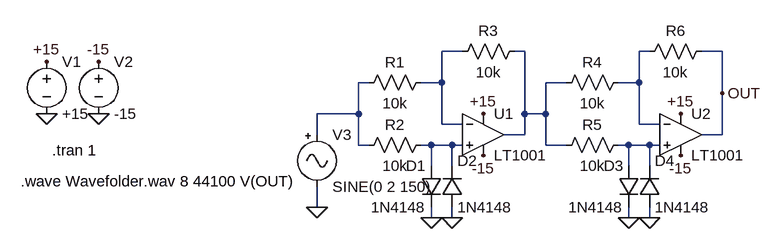
[diagram p0: schematic Wavefolder.asc]
Wavefolder.asc, the LTspice schematic file:
Version 4
SHEET 1 880 680
WIRE 128 0 96 0
WIRE 224 0 208 0
WIRE 416 0 400 0
WIRE 528 0 496 0
WIRE -16 48 -32 48
WIRE 96 48 96 0
WIRE 96 48 64 48
WIRE 288 48 256 48
WIRE 400 48 400 0
WIRE 400 48 368 48
WIRE 528 64 528 0
WIRE -32 96 -32 48
WIRE -32 96 -96 96
WIRE 224 96 224 0
WIRE 256 96 256 48
WIRE 256 96 224 96
WIRE 96 112 96 48
WIRE 128 112 96 112
WIRE 400 112 400 48
WIRE 432 112 400 112
WIRE -96 128 -96 96
WIRE 224 128 224 96
WIRE 224 128 192 128
WIRE 528 128 528 64
WIRE 528 128 496 128
WIRE -32 144 -32 96
WIRE -16 144 -32 144
WIRE 80 144 64 144
WIRE 112 144 80 144
WIRE 128 144 112 144
WIRE 256 144 256 96
WIRE 288 144 256 144
WIRE 384 144 368 144
WIRE 416 144 384 144
WIRE 432 144 416 144
WIRE 80 176 80 144
WIRE 112 176 112 144
WIRE 384 176 384 144
WIRE 416 176 416 144
WIRE -96 240 -96 208
WIRE 80 256 80 240
WIRE 112 256 112 240
WIRE 384 256 384 240
WIRE 416 256 416 240
FLAG 160 160 -15
FLAG 160 96 +15
FLAG -512 96 0
FLAG -432 96 0
FLAG -512 16 +15
FLAG -432 16 -15
FLAG -96 240 0
FLAG 80 256 0
FLAG 112 256 0
FLAG 464 160 -15
FLAG 464 96 +15
FLAG 384 256 0
FLAG 416 256 0
FLAG 528 64 OUT
SYMBOL Opamps\\LT1001 160 64 R0
SYMATTR InstName U1
SYMBOL voltage -512 0 R0
WINDOW 123 0 0 Left 0
WINDOW 39 0 0 Left 0
SYMATTR InstName V1
SYMATTR Value +15
SYMBOL voltage -432 0 R0
WINDOW 123 0 0 Left 0
WINDOW 39 0 0 Left 0
SYMATTR InstName V2
SYMATTR Value -15
SYMBOL res 80 32 R90
WINDOW 0 0 56 VBottom 0
WINDOW 3 32 56 VTop 0
SYMATTR InstName R1
SYMATTR Value 10k
SYMBOL res 80 128 R90
WINDOW 0 0 56 VBottom 0
WINDOW 3 32 56 VTop 0
SYMATTR InstName R2
SYMATTR Value 10k
SYMBOL res 224 -16 R90
WINDOW 0 0 56 VBottom 0
WINDOW 3 32 56 VTop 0
SYMATTR InstName R3
SYMATTR Value 10k
SYMBOL Misc\\signal -96 112 R0
WINDOW 123 0 0 Left 0
WINDOW 39 0 0 Left 0
SYMATTR InstName V3
SYMATTR Value SINE(0 2 150)
SYMBOL diode 96 176 M0
SYMATTR InstName D1
SYMATTR Value 1N4148
SYMBOL diode 96 240 M180
WINDOW 0 24 72 Left 0
WINDOW 3 24 0 Left 0
SYMATTR InstName D2
SYMATTR Value 1N4148
SYMBOL res 384 32 R90
WINDOW 0 0 56 VBottom 0
WINDOW 3 32 56 VTop 0
SYMATTR InstName R4
SYMATTR Value 10k
SYMBOL res 384 128 R90
WINDOW 0 0 56 VBottom 0
WINDOW 3 32 56 VTop 0
SYMATTR InstName R5
SYMATTR Value 10k
SYMBOL Opamps\\LT1001 464 64 R0
SYMATTR InstName U2
SYMBOL diode 400 176 M0
SYMATTR InstName D3
SYMATTR Value 1N4148
SYMBOL diode 400 240 M180
WINDOW 0 24 72 Left 0
WINDOW 3 24 0 Left 0
SYMATTR InstName D4
SYMATTR Value 1N4148
SYMBOL res 512 -16 R90
WINDOW 0 0 56 VBottom 0
WINDOW 3 32 56 VTop 0
SYMATTR InstName R6
SYMATTR Value 10k
TEXT -504 152 Left 0 !.tran 1
TEXT -552 200 Left 0 !.wave Wavefolder.wav 8 44100 V(OUT)

The netlist it stands for:
* Wavefolder.asc
XU1 N005 N001 +15 -15 N002 LT1001  ; pins In+ In- V+ V- OUT
V1 +15 0 +15
V2 -15 0 -15
R1 N001 N004 10k
R2 N005 N004 10k
R3 N002 N001 10k
V3 N004 0 SINE(0 2 150)
D1 N005 0 1N4148
D2 0 N005 1N4148
R4 N003 N002 10k
R5 N006 N002 10k
XU2 N006 N003 +15 -15 OUT LT1001  ; pins In+ In- V+ V- OUT
D3 N006 0 1N4148
D4 0 N006 1N4148
R6 OUT N003 10k
.model D D
.lib standard.dio
.tran 1
.wave Wavefolder.wav 8 44100 V(OUT)
.lib LTC.lib
.backanno
.end